# EAGLE board VET6_POD (EAGLE 4.13), part 1 of 2
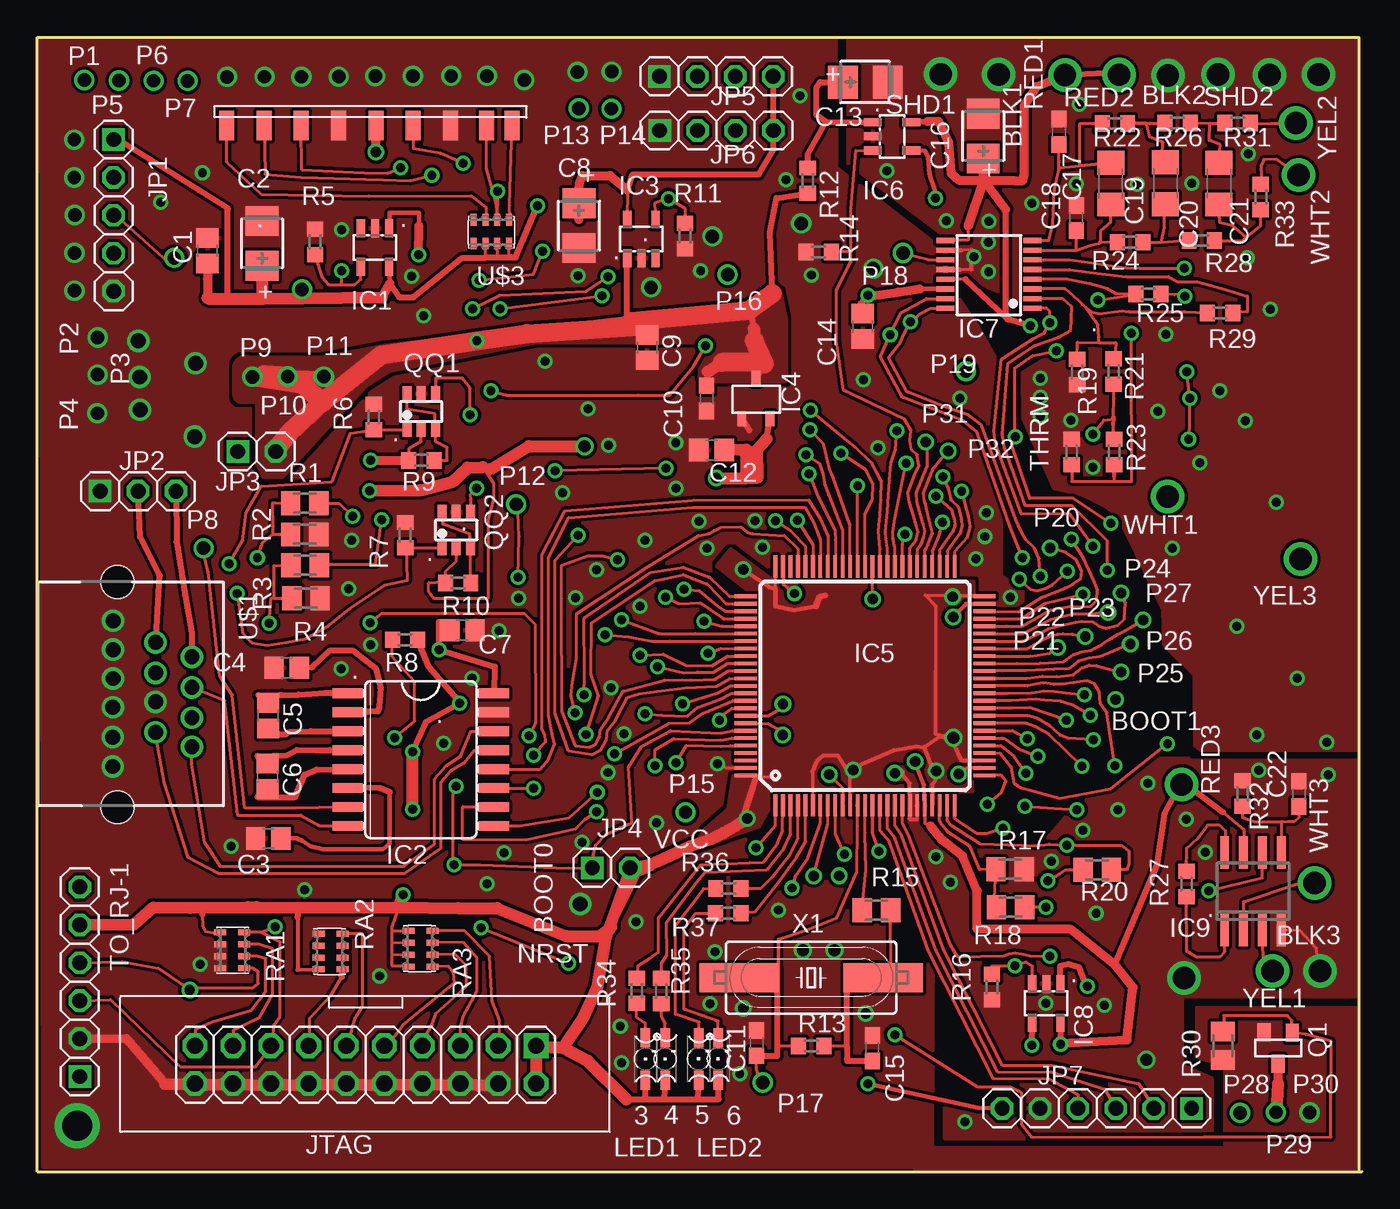
[diagram p2: board, top side]
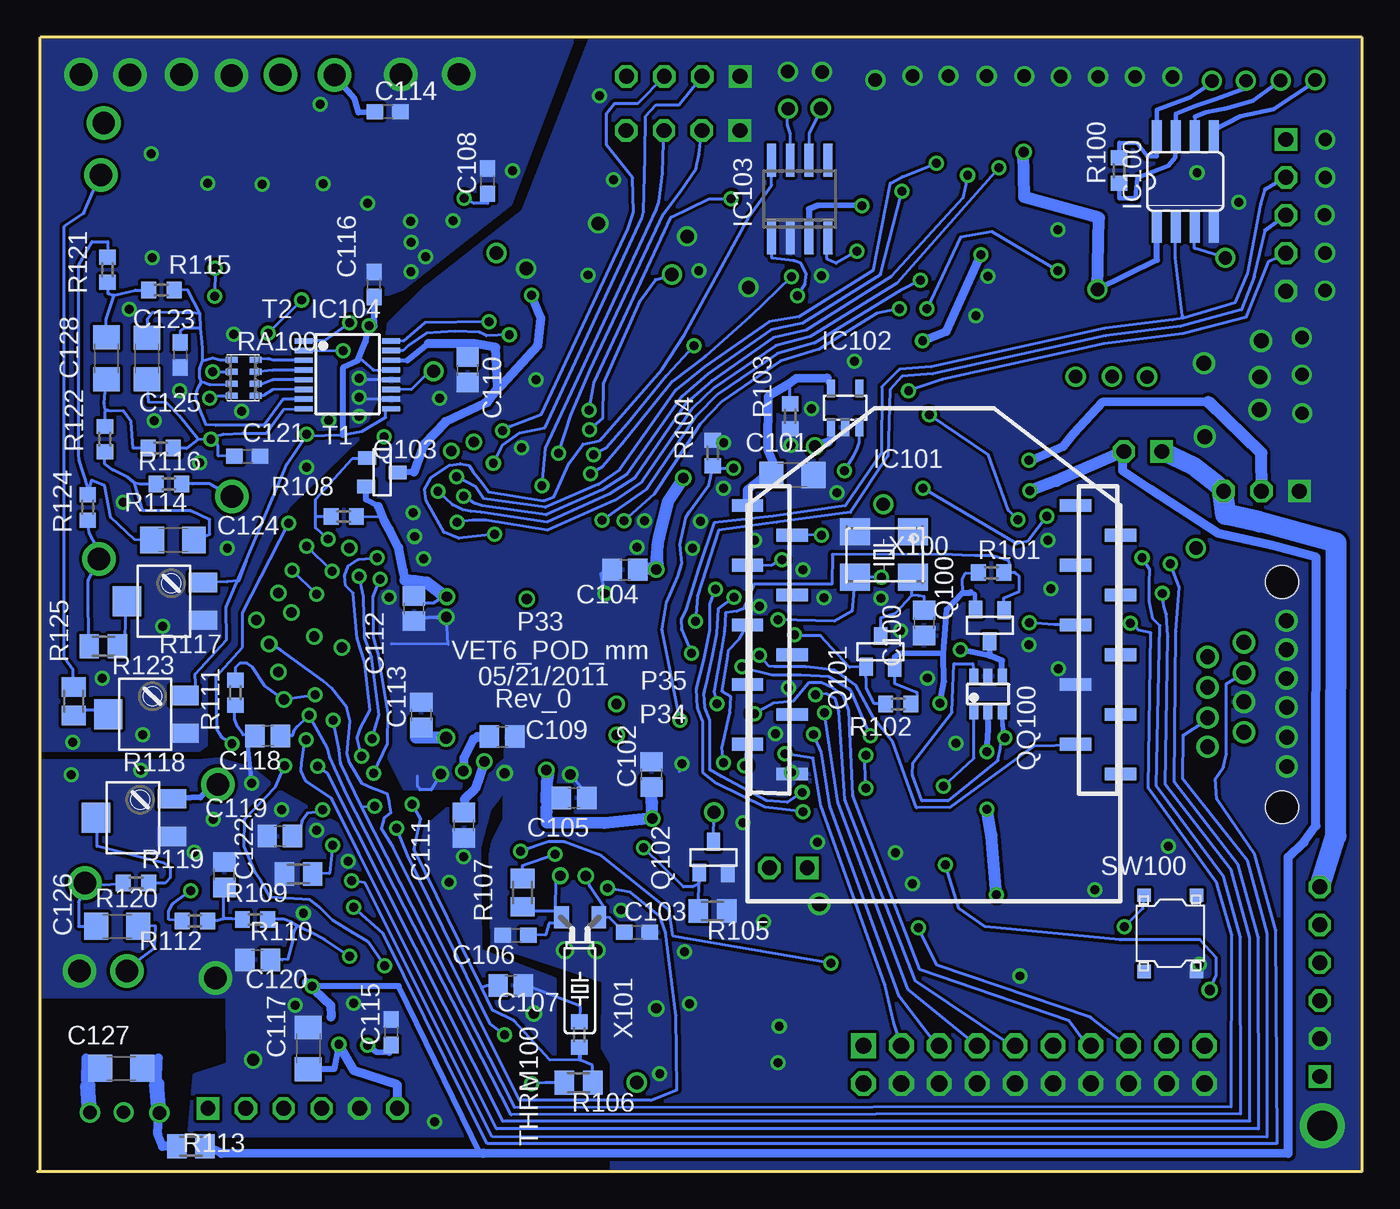
[diagram p3: board, bottom side, seen from below]

Size 88.8 x 76 mm. Coordinates in mm from the lower left corner, seen from the top.
Outline: 88.6,0 0,0 0,76 88.6,76 88.6,0
Outline: 88.6,0 88.8,0
Copper layers (1*16): Top 0.035mm / dielectric 1.5mm / Bottom 0.035mm
Design rules "default": minimum track width 8mil, minimum drill 0.6mm, track to track 8.5mil, track to pad 8mil, pad to pad 8mil, via to via 8mil, smd to smd 0mil, copper to edge 1mil, drill to drill 9mil, minimum pad ring 8mil, minimum via ring 8mil, stop-mask expansion 4mil, vias tented up to drill 0mil, thermal gap 0mil
tRestrict: area 40.2,7 to 46.2,8.2

## Footprints (pad centres in the part's own frame; a part is rotated, then mirrored left to right if it is on the bottom)
SOLPAD060 = drill 1.5 pad 2.184 round: MP 0,0
SOLPAD028 = drill 0.7 pad 1.016 round: MP 0,0
C0805 = smd 1.3 x 1.5: 1 -0.85,0; 2 0.85,0
CT3528 = smd 2 x 2.2: + 1.5,0; - -1.5,0
C0603 = smd 1.1 x 1: 1 -0.85,0; 2 0.85,0
C1206 = smd 1.6 x 1.8: 1 -1.4,0; 2 1.4,0
SOT-25 = smd 0.55 x 1.2: 1 -0.95,-1.3; 2 0,-1.3; 3 0.95,-1.3; 4 0.95,1.3; 5 -0.95,1.3
SO16L = smd 0.66 x 2.032: 1 -4.445,-4.902; 2 -3.175,-4.902; 3 -1.905,-4.902; 4 -0.635,-4.902; 5 0.635,-4.902; 6 1.905,-4.902; 7 3.175,-4.902; 8 4.445,-4.902; 9 4.445,4.902; 10 3.175,4.902; 11 1.905,4.902; 12 0.635,4.902; 13 -0.635,4.902; 14 -1.905,4.902; 15 -3.175,4.902; 16 -4.445,4.902
SOT-23A = smd 0.6 x 1: P$1 -0.95,-1.35; P$2 0.95,-1.35; P$3 0,1.35
TQFP100 = smd 1.5 x 0.25: 1 -8,6; 2 -8,5.5; 3 -8,5; 4 -8,4.5; 5 -8,4; 6 -8,3.5; 7 -8,3; 8 -8,2.5; 9 -8,2; 10 -8,1.5; 11 -8,1; 12 -8,0.5; 13 -8,0; 14 -8,-0.5; 15 -8,-1; 16 -8,-1.5; 17 -8,-2; 18 -8,-2.5; 19 -8,-3; 20 -8,-3.5; 21 -8,-4; 22 -8,-4.5; 23 -8,-5; 24 -8,-5.5; 25 -8,-6; 51 8,-6; 52 8,-5.5; 53 8,-5; 54 8,-4.5; 55 8,-4; 56 8,-3.5; 57 8,-3; 58 8,-2.5; 59 8,-2; 60 8,-1.5; 61 8,-1; 62 8,-0.5; 63 8,0; 64 8,0.5; 65 8,1; 66 8,1.5; 67 8,2; 68 8,2.5; 69 8,3; 70 8,3.5; 71 8,4; 72 8,4.5; 73 8,5; 74 8,5.5; 75 8,6 | smd 0.25 x 1.5: 26 -6,-8; 27 -5.5,-8; 28 -5,-8; 29 -4.5,-8; 30 -4,-8; 31 -3.5,-8; 32 -3,-8; 33 -2.5,-8; 34 -2,-8; 35 -1.5,-8; 36 -1,-8; 37 -0.5,-8; 38 0,-8; 39 0.5,-8; 40 1,-8; 41 1.5,-8; 42 2,-8; 43 2.5,-8; 44 3,-8; 45 3.5,-8; 46 4,-8; 47 4.5,-8; 48 5,-8; 49 5.5,-8; 50 6,-8; 76 6,8; 77 5.5,8; 78 5,8; 79 4.5,8; 80 4,8; 81 3.5,8; 82 3,8; 83 2.5,8; 84 2,8; 85 1.5,8; 86 1,8; 87 0.5,8; 88 0,8; 89 -0.5,8; 90 -1,8; 91 -1.5,8; 92 -2,8; 93 -2.5,8; 94 -3,8; 95 -3.5,8; 96 -4,8; 97 -4.5,8; 98 -5,8; 99 -5.5,8; 100 -6,8
TSSPO16 = smd 0.35 x 1.2: 1 -0.975,-3.025; 2 -0.325,-3.025; 3 0.325,-3.025; 4 0.975,-3.025; 5 1.625,-3.025; 6 2.275,-3.025; 7 2.925,-3.025; 8 3.575,-3.025; 9 3.575,2.825; 10 2.925,2.825; 11 2.275,2.825; 12 1.625,2.825; 13 0.975,2.825; 14 0.325,2.825; 15 -0.325,2.825; 16 -0.975,2.825
SO08 = smd 0.6 x 2.2: 1 -1.905,-2.6; 2 -0.635,-2.6; 3 0.635,-2.6; 4 1.905,-2.6; 5 1.905,2.6; 6 0.635,2.6; 7 -0.635,2.6; 8 -1.905,2.6
SO08' = smd 0.66 x 2.032: 1 -1.905,-3.073; 2 -0.635,-3.073; 3 0.635,-3.073; 4 1.905,-3.073; 5 1.905,3.073; 6 0.635,3.073; 7 -0.635,3.073; 8 -1.905,3.073
XBEE_PRO_SMD = smd 2.1 x 0.85: P$1 -12.5,0; P$2 -9.5,-2; P$3 -12.5,-4; P$4 -9.5,-6; P$5 -12.5,-8; P$6 -9.5,-10; P$7 -12.5,-12; P$8 -9.5,-14; P$9 -12.5,-16; P$10 -9.5,-18; P$11 12.5,-18; P$12 9.5,-16; P$13 12.5,-14; P$14 9.5,-12; P$15 12.5,-10; P$16 9.5,-8; P$17 12.5,-6; P$18 9.5,-4; P$19 12.5,-2; P$20 9.5,0
SO-08 = smd 0.6 x 2.2: 1 -1.905,-2.6; 2 -0.635,-2.6; 3 0.635,-2.6; 4 1.905,-2.6; 5 1.905,2.6; 6 0.635,2.6; 7 -0.635,2.6; 8 -1.905,2.6
1X05 = drill 1 square: 1 -5.08,0 | drill 1 octagon: 2 -2.54,0; 3 0,0; 4 2.54,0; 5 5.08,0
1X03 = drill 1 square: 1 -2.54,0 | drill 1 octagon: 2 0,0; 3 2.54,0
1X02 = drill 1 square: 1 -1.27,0 | drill 1 octagon: 2 1.27,0
1X04 = drill 1 square: 1 -3.81,0 | drill 1 octagon: 2 -1.27,0; 3 1.27,0; 4 3.81,0
1X06 = drill 1 square: 1 -6.35,0 | drill 1 octagon: 2 -3.81,0; 3 -1.27,0; 4 1.27,0; 5 3.81,0; 6 6.35,0
2X10_KEYED = drill 1.1 square: 1 -11.46,-1.27 | drill 1.1 octagon: 2 -11.46,1.27; 3 -8.92,-1.27; 4 -8.92,1.27; 5 -6.38,-1.27; 6 -6.38,1.27; 7 -3.84,-1.27; 8 -3.84,1.27; 9 -1.3,-1.27; 10 -1.3,1.27; 11 1.24,-1.27; 12 1.24,1.27; 13 3.78,-1.27; 14 3.78,1.27; 15 6.32,-1.27; 16 6.32,1.27; 17 8.86,-1.27; 18 8.86,1.27; 19 11.4,-1.27; 20 11.4,1.27
CHIP2LED_1210 = smd 1.27 x 0.635: A -1.422,0.67; A1 -1.422,-0.64; C 1.422,0.67; C1 1.422,-0.64
SOLDPAD035 = drill 0.9 pad 1.27 round: MP 0,0
SOLPAD0.6 = drill 0.7 pad 1.016 round: MP 0,0
SOT-23 = smd 0.9 x 1.2: 1 -1,-1.006; 2 0.9,-1.056; 3 -0.05,1.056
TSOP6 = smd 0.6 x 1: P$1 -0.95,-1.2; P$2 0,-1.2; P$3 0.95,-1.2; P$4 0.95,1.2; P$5 0,1.2; P$6 -0.95,1.2
M0805 = smd 1.3 x 1.6: 1 -0.95,0; 2 0.95,0
R0603 = smd 1 x 1.1: 1 -0.85,0; 2 0.85,0
SM42X = smd 1.3 x 1.9: A -1.27,-2.55; E 1.27,-2.55 | smd 2 x 1.9: S 0,2.55
EXB-38 = smd 0.4 x 0.8: P$1 -1.2,0.7; P$2 -0.4,0.7; P$3 0.4,0.7; P$4 1.2,0.7; P$5 1.2,-0.9; P$6 0.4,-0.9; P$7 -0.4,-0.9; P$8 -1.2,-0.9
E-SWITCH = smd 0.9 x 0.9: P$1 -2.55,1.75; P$2 2.55,1.75; P$3 -2.55,-1.75; P$4 2.55,-1.75
8P8C = drill 1 round: 1 3.445,4.99; 2 2.475,2.55; 3 1.505,4.99; 4 0.435,2.55; 5 -0.535,4.99; 6 -1.505,2.55; 7 -2.575,4.99; 8 -3.545,2.55 | hole 2.2: -7.6,0; 7.5,0
SD_CARD_SMD_PADS_STRAIN_HOLES = smd 1 x 2: P$1 6.77,1.385; P$2 4.27,1.385; P$3 1.77,1.385; P$4 -0.73,1.385; P$5 -3.23,1.385; P$6 -5.73,1.385; P$7 -8.15,1.385; P$8 -9.85,1.385; P$9 9.27,1.385
HC49UP = smd 5.334 x 1.93: 1 -4.826,0; 2 4.826,0
FOX924B_TCXO = smd 2 x 1.8: 1 -1.894,-1.524; 2 1.994,-1.524; 3 1.994,1.524; 4 -1.894,1.524
TC26H_SMD = smd 1 x 1.5: P$1 -1.29,-0.12; P$2 1.21,-0.12

## Placement (x,y rotation side)
BLK1  SOLPAD060  [SOLPAD060]  64.45,73.52 0 top
BLK2  SOLPAD060  [SOLPAD060]  79.15,73.51 90 top
BLK3  SOLPAD060  [SOLPAD060]  85.97,13.45 0 top
BOOT1  BOOT1  [SOLPAD028]  72.27,31.63 0 top
C1  .1u  [C0805]  11.4,61.7 90 top
C2  47u  [CT3528]  15.06,62.2 270 top
C3  .1u  [C0805]  15.48,22.33 180 top
C4  .1u  [C0805]  16.73,33.76 180 top
C5  .1u  [C0805]  15.48,30.55 270 top
C6  .1u  [C0805]  15.44,26.48 270 top
C7  .1u  [C0805]  28.49,36.27 0 top
C8  4.7u@10v  [CT3528]  36.31,63.38 90 top
C9  .1u  [C0805]  40.88,55.21 270 top
C10  2.2u@16v  [C0603]  44.86,51.8 270 top
C11  15p  [C0603]  48.21,8.62 270 top
C12  4.7u@10v  [C0805]  45.19,48.34 180 top
C13  4.7u@10V  [CT3528]  55.49,73 180 top
C14  .1u  [C0805]  55.33,56.64 270 top
C15  15p  [C0603]  55.96,8.27 270 top
C16  4.7u@10V  [CT3528]  63.4,69.38 270 top
C17  1n  [C0603]  68.48,69.68 90 top
C18  1n  [C0603]  69.63,63.9 90 top
C19  22u@6.3v  [C1206]  71.95,66.2 270 top
C20  22u@6.3v  [C1206]  75.61,66.22 270 top
C21  22u@6.3v  [C1206]  79.19,66.2 270 top
C22  1n  [C0603]  84.56,25.31 90 top
C100  .1u  [C0805]  29.37,36.77 270 bottom
C101  4.7u@10v  [C1206]  38.18,46.68 0 bottom
C102  .1u  [C0805]  47.64,26.62 90 bottom
C103  10p  [C0603]  48.6,16.03 0 bottom
C104  .1u  [C0805]  49.41,40.33 180 bottom
C105  .1u  [C0805]  52.83,25.04 0 bottom
C106  10p  [C0603]  56.74,15.85 180 bottom
C107  .1u  [C0805]  57.07,12.48 0 bottom
C108  470p  [C0603]  58.61,66.37 90 bottom
C109  .1u  [C0805]  57.65,29.14 0 bottom
C110  .1u  [C0805]  59.96,53.72 270 bottom
C111  .1u  [C0805]  60.2,23.21 270 bottom
C112  .1u  [C0805]  63.56,37.73 270 bottom
C113  .1u  [C0805]  63.06,30.6 90 bottom
C114  .1u  [C0603]  65.31,71.01 0 bottom
C115  470p  [C0603]  65.07,9.34 90 bottom
C116  .1u  [C0603]  66.23,59.44 90 bottom
C117  4.7u@10v  [C1206]  70.65,8.26 90 bottom
C118  .1u  [C0805]  73.35,29.2 180 bottom
C119  .1u  [C0805]  72.55,22.48 180 bottom
C120  .1u  [C0805]  74.04,14.19 0 bottom
C121  1n  [C0603]  74.73,47.93 0 bottom
C122  .1u  [C0805]  76.27,19.89 90 bottom
C123  1n  [C0603]  79.21,54.71 270 bottom
C124  22u@6.3v  [C1206]  79.7,42.32 0 bottom
C125  22u@6.3v  [C1206]  81.45,54.48 270 bottom
C126  22u@6.3v  [C1206]  83.45,16.44 180 bottom
C127  4.7u@10v  [C1206]  83.17,6.92 180 bottom
C128  22u@6.3v  [C1206]  84.17,54.5 270 bottom
IC1  XC6701  [SOT-25]  22.64,61.92 180 top
IC2  MAX3232CDW  [SO16L]  25.7,27.61 270 top
IC3  XC6701  [SOT-25]  40.49,62.49 0 top
IC4  MCP1702  [SOT-23A]  48.16,51.8 0 top
IC5  STM32F10XVXT6  [TQFP100]  55.48,32.55 90 top
IC6  MIC5205  [SOT-25]  57.29,69.37 270 top
IC7  AD7799  [TSSPO16]  63.68,58.82 90 top
IC8  MIC5205  [SOT-25]  67.62,11.27 180 top
IC9  IN337  [SO08]  81.48,18.79 0 top
IC100  MAX3488CSA  [SO08']  11.86,66.34 0 bottom
IC101  XBEE-PROSMD  [XBEE_PRO_SMD]  28.7,44.63 0 bottom
IC102  REG113  [SOT-25]  34.65,51.17 0 bottom
IC103  MCP2551  [SO-08]  37.7,65.16 0 bottom
IC104  AD7799  [TSSPO16]  67.91,54.69 270 bottom
JP1  GPS  [1X05]  5.11,64.08 270 top
JP2  BATT  [1X03]  6.75,45.6 0 top
JP3  PWR  [1X02]  14.71,48.25 0 top
JP4  BOOT0  [1X02]  38.47,20.36 0 top
JP5  ENC_1  [1X04]  45.51,73.38 0 top
JP6  ENC_2  [1X04]  45.52,69.76 0 top
JP7  ACCEL  [1X06]  71.02,4.24 180 top
JTAG  JTAG  [2X10_KEYED]  21.97,7.17 180 top
LED1  LED1210_2  [CHIP2LED_1210]  41.43,7.55 90 top
LED2  LED1210_2  [CHIP2LED_1210]  45,7.56 90 top
P1  P9  [SOLDPAD035]  3.15,73.14 0 top
P2  GND  [SOLDPAD035]  4.04,55.89 90 top
P3  GND  [SOLDPAD035]  4.04,53.4 270 top
P4  GND  [SOLDPAD035]  4.03,50.81 90 top
P5  P9  [SOLDPAD035]  5.47,73.11 0 top
P6  P9  [SOLDPAD035]  7.79,73.09 0 top
P7  P9  [SOLDPAD035]  10.07,73.08 0 top
P8  P9  [SOLDPAD035]  11.14,41.78 0 top
P9  +7V  [SOLDPAD035]  14.41,53.26 0 top
P10  +7V  [SOLDPAD035]  16.78,53.28 0 top
P11  +7V  [SOLDPAD035]  19.21,53.27 0 top
P12  PD0  [SOLDPAD035]  32.09,44.72 0 top
P13  +7V  [SOLDPAD035]  36.3,71.24 0 top
P14  +7V  [SOLDPAD035]  38.48,71.21 0 top
P15  PE2_FET  [SOLDPAD035]  43.45,24.08 0 top
P16  PC8  [SOLDPAD035]  46.27,60.11 0 top
P17  OSC_IN  [SOLDPAD035]  48.62,5.97 0 top
P18  PSW_1  [SOLDPAD035]  58.02,61.55 0 top
P19  PSW_2  [SOLDPAD035]  62.24,53.63 0 top
P20  SOLDPAD028  [SOLPAD028]  67.89,41.79 0 top
P21  PE11  [SOLPAD028]  68.39,35.11 0 top
P22  PE12  [SOLPAD028]  70.24,35.86 0 top
P23  PE14  [SOLPAD028]  71.76,37.46 0 top
P24  PE13  [SOLPAD028]  72.64,38.77 0 top
P25  PE8  [SOLPAD028]  72.65,33.47 0 top
P26  PE9  [SOLPAD028]  73.26,35.36 0 top
P27  PE10  [SOLPAD028]  74.1,36.95 0 top
P28  +7V  [SOLDPAD035]  80.62,3.94 0 top
P29  BEEP  [SOLDPAD035]  83.01,3.98 0 top
P30  +7V  [SOLDPAD035]  85.27,3.96 0 top
P31  SOLPAD028  [SOLPAD028]  59.54,48.89 0 top
P32  SOLPAD028  [SOLPAD028]  61.06,48.28 0 top
P33  SOLPAD0.6  [SOLPAD0.6]  55.98,38.37 0 top
P34  SOLPAD0.6  [SOLPAD0.6]  49.96,29.25 0 top
P35  SOLPAD0.6  [SOLPAD0.6]  49.98,31.33 0 top
Q1  IRLML2060  [SOT-23]  83.12,8.29 180 top
Q100  IRLML5103  [SOT-23]  25.01,36.6 180 bottom
Q101  IRLML5103  [SOT-23]  32.23,34.83 0 bottom
Q102  IRLML2060  [SOT-23]  43.43,21.05 0 bottom
Q103  IRLML5103  [SOT-23]  65.7,46.8 270 bottom
QQ1  AO6604  [TSOP6]  25.73,50.92 0 top
QQ2  AO6604  [TSOP6]  28.08,42.99 0 top
QQ100  AO6604  [TSOP6]  25.08,32 0 bottom
R1  18K  [M0805]  17.93,44.8 180 top
R2  10K  [M0805]  17.93,42.69 0 top
R3  3.9K  [M0805]  17.95,40.64 180 top
R4  10K  [M0805]  18.01,38.41 0 top
R5  470K  [R0603]  18.62,62.3 270 top
R6  1M  [R0603]  22.56,50.56 270 top
R7  1M  [R0603]  24.66,42.64 270 top
R8  10K  [R0603]  24.65,35.64 180 top
R9  470K  [R0603]  25.74,47.66 0 top
R10  470K  [R0603]  28.21,39.44 0 top
R11  1M  [R0603]  43.41,62.69 270 top
R12  100  [R0603]  51.64,66.39 270 top
R13  470K  [R0603]  51.87,8.42 0 top
R14  470K  [R0603]  52.37,61.62 0 top
R15  56  [M0805]  56.24,17.51 0 top
R16  1M  [R0603]  63.98,12.37 270 top
R17  1M  [M0805]  65.2,20.25 0 top
R18  10K  [M0805]  65.23,17.72 180 top
R19  33K  [R0603]  69.69,53.58 90 top
R20  10K  [M0805]  71.03,20.22 0 top
R21  10K  [R0603]  72.14,53.61 270 top
R22  330  [R0603]  72.22,70.24 180 top
R23  10K  [R0603]  72.17,48.23 90 top
R24  330  [R0603]  73.23,62.27 180 top
R25  10K  [R0603]  74.47,58.79 0 top
R26  330  [R0603]  76.42,70.25 180 top
R27  2K  [R0603]  77.02,19.27 90 top
R28  330  [R0603]  78.05,62.39 180 top
R29  10K  [R0603]  79.27,57.53 0 top
R30  1M  [M0805]  79.45,8.44 270 top
R31  100  [R0603]  80.45,70.25 180 top
R32  200K  [R0603]  80.77,25.33 270 top
R33  100  [R0603]  82,65.31 270 top
R34  510  [R0603]  40.17,12.12 270 top
R35  510  [R0603]  41.83,12.1 270 top
R36  510  [R0603]  46.32,18.98 180 top
R37  510  [R0603]  46.31,17.31 180 top
R100  120  [R0603]  16.29,67.07 90 bottom
R101  470K  [R0603]  24.86,40.13 0 bottom
R102  470K  [R0603]  31.09,31.34 180 bottom
R103  2K  [R0603]  38.33,50.61 90 bottom
R104  1M  [R0603]  43.53,48.15 90 bottom
R105  1M  [M0805]  43.55,17.46 0 bottom
R106  7.15K  [M0805]  52.52,5.95 0 bottom
R107  47K  [M0805]  56.27,18.7 270 bottom
R108  470K  [R0603]  68.26,43.89 180 bottom
R109  1M  [M0805]  71.3,19.94 180 bottom
R110  1K  [R0603]  74.2,16.89 0 bottom
R111  10K  [R0603]  75.51,32.09 90 bottom
R112  1K  [R0603]  78.23,16.81 180 bottom
R113  100  [M0805]  78.5,1.69 0 bottom
R114  100  [R0603]  79.98,46.09 180 bottom
R115  330  [R0603]  80.48,59.06 0 bottom
R116  330  [R0603]  80.53,48.48 0 bottom
R117  20K  [SM42X]  80.25,38.21 90 bottom
R118  20K  [SM42X]  81.49,30.64 90 bottom
R119  20K  [SM42X]  82.32,23.71 90 bottom
R120  10K  [R0603]  82.18,19.33 180 bottom
R121  330  [R0603]  84.09,60.43 270 bottom
R122  330  [R0603]  84.28,49.07 90 bottom
R123  10K  [M0805]  84.37,35.21 180 bottom
R124  100  [R0603]  85.42,44.51 90 bottom
R125  10K  [M0805]  86.36,31.51 270 bottom
RA1  10K  [EXB-38]  13.16,14.83 270 top
RA2  10K  [EXB-38]  19.55,14.75 90 top
RA3  10K  [EXB-38]  25.59,14.94 90 top
RA100  10K  [EXB-38]  75.07,53.19 90 bottom
RED1  SOLPAD060  [SOLPAD060]  68.88,73.49 0 top
RED2  SOLPAD060  [SOLPAD060]  72.49,73.49 90 top
RED3  SOLPAD060  [SOLPAD060]  76.7,25.95 0 top
SHD1  SOLPAD060  [SOLPAD060]  60.54,73.53 0 top
SHD2  SOLPAD060  [SOLPAD060]  85.88,73.52 90 top
SW100  E-SWITCH  [E-SWITCH]  12.86,15.97 90 bottom
THRM  10K  [R0603]  69.32,48.22 90 top
THRM100  10K  [R0603]  52.47,9.18 90 bottom
TO_RJ-1  [1X06]  2.85,12.72 90 top
U$1  RJ-45  [8P8C]  5.37,31.91 270 top
U$2  SD_SMD_PADSSTRAIN_HOLES  [SD_CARD_SMD_PADS_STRAIN_HOLES]  21.97,71.47 180 top
U$3  10K  [EXB-38]  30.43,62.89 180 top
WHT1  SOLPAD060  [SOLPAD060]  75.76,45.22 90 top
WHT2  SOLPAD060  [SOLPAD060]  84.54,66.77 0 top
WHT3  SOLPAD060  [SOLPAD060]  85.61,19.34 0 top
X1  10 MHZ  [HC49UP]  51.86,13 180 top
X100  FOX924B  [FOX924B_TCXO]  32.01,41.34 180 bottom
X101  32768  [TC26H_SMD]  52.46,16.92 180 bottom
YEL1  SOLPAD060  [SOLPAD060]  82.8,13.45 0 top
YEL2  SOLPAD060  [SOLPAD060]  84.35,70.26 0 top
YEL3  SOLPAD060  [SOLPAD060]  84.67,41.06 90 top

## Tracks (layer width: path | path; a pad name or v marks a point on that pad's centre or on a via)
3.3V_SD_CARD|GPS  (via drill 0.6, 0.7, 0.9)
  Top 0.203: IC1.5 23.61,59.48 | 30.08,61.25 30.03,61.24 30.03,61.26 U$3.P$3 | U$3.P$1 31.62,62.11 31.62,61.27 31.7,61.25 31.77,61.28 | 30.84,61.25 30.84,61.24 U$3.P$2
  Top 0.305: 23.63,59.52 IC1.5
  Top 0.406: 23.61,59.48 24.23,58.6 25.19,58.57 28.48,61.23 30.03,61.24 | 30.08,61.25 30.84,61.25 31.7,61.25 | 11.55,58.48 11.49,58.53 12.77,58.55 12.77,64.53 5.69,68.95 4.73,69.18 JP1.1 | 11.41,58.54 11.43,58.5 | v33.52,64.72 32.06,61.26 31.77,61.28
  Top 0.61: 11.41,58.54 11.41,59.8 11.39,60.81 C1.1 | 23.09,58.58 23.63,59.52 | v22.71,68.3 U$2.P$4
  Top 0.813: 15.12,58.48 C2.+ | 11.41,58.54 11.55,58.48 15.12,58.48 | 15.12,58.48 17.76,58.51 | 17.76,58.51 23.09,58.58 | 17.76,58.51 v17.75,59.11
  Bottom 0.406: IC100.1 13.76,61.09 17.84,59.08 v17.75,59.11 | IC103.3 37.08,64.49 36.45,64.74 v33.52,64.72
  Bottom 0.813: v22.71,68.3 22.66,65.29 17.65,63.9 v17.75,59.11
3.3V_TXCO+SUPPLY
  Bottom 0.203: Q101.3 32.28,37.08 31.32,37.4 30.18,38.6 | X100.4 30.16,39.69 30.18,38.6 | 30.18,38.6 29.71,38.58 29.36,38.53 29.35,37.69 C100.1
+3.3V/XB
  Bottom 0.203: R103.2 38.38,51.98 38.39,52.87 38.5,52.74
  Bottom 0.406: 35.86,53.18 IC102.5
  Bottom 0.61: 35.86,53.18 37.94,53.16 38.5,52.74 39.79,51.97 39.83,48.34 39.13,46.73 C101.1 39.09,46.48 40.19,46.5 41.19,45.71 IC101.P$1
+5V/2  (via drill 0.6)
  Top 0.203: 60.82,62.35 IC7.9 60.89,62.4 62.4,62.41 62.38,63.35 | R21.2 72.17,51.79 72.13,50.56 | R23.2 72.1,49.27 72.1,50.05 | v70.75,49.4 70.98,49.72 71.48,50.34 72.18,50.45 72.12,50.45 | 62.21,59.79 IC7.13
  Top 0.254: 72.1,50.05 72.12,50.45 72.13,50.56
  Top 0.406: 64.91,64.47 64.91,57.67 64.91,57.63 64.99,57.14 65.05,57.12 | 59.68,70.35 IC6.5 | 65.31,66.41 65.46,66.41 | 63.43,66.42 63.49,66.42 63.49,66.4 | RED2.MP 73,73.69 RED1.MP | v66.57,56.66 65.05,57.12 | 62.21,59.79 63.83,58.24 65.05,57.11 65.05,57.12
  Top 0.61: RED1.MP 66.95,72.69 66.17,71.5 66.16,66.82 66.04,66.4 65.46,66.41 | 59.68,70.35 60.43,70.36 61.09,68.93 61.27,66.84 61.81,66.4 63.43,66.4 | 63.43,66.42 C16.+ | 63.49,66.42 65.31,66.41 | 63.43,66.4 63.49,66.4 63.48,66.38 64.91,64.47 | 63.43,66.4 63.43,66.41 62.38,63.35
  Bottom 0.203: IC104.9 65.45,51.14 65.45,50.53 67.02,49.62 68.31,49.36 70.71,49.3 70.77,49.31 | 68.3,53.89 68.04,54.04 67.24,54.52 66.3,53.71 IC104.13 | R117.E 76.08,39.51 75.3,39.59 74.79,40.94 | 74.79,40.94 72.05,47.44 70.77,49.31 | R118.E 78.83,32.18 78.14,32.06 78.22,33.33 76.11,35.62 76.13,37.82 74.79,40.94 | v70.75,49.4 71.12,49.53 70.77,49.31
  Bottom 0.406: RED1.MP 68.96,73.67 68.23,72.69 67.58,71.93 67.28,70.98 C114.1 | 68.31,49.36 68.3,53.89 67.32,54.34 66.78,55.63 v66.57,56.66 66.19,56.67 66.24,57.56 C116.1
+5V/3
  Top 0.203: 39.55,65.77 IC3.5 | C8.+ 36.31,63.81
  Top 0.406: 39.55,65.77 39.9,66.81 48.37,66.81 49.33,68.45 49.38,69.75 JP6.4 49.34,73.32 JP5.4 | 36.35,66.27 36.35,65.91
  Top 0.61: 39.55,65.77 38.39,66.73 36.54,66.73 36.35,66.27 36.31,65.74 36.31,63.81
+7V  (via drill 0.6, 0.8)
  Top 0.203: QQ2.P$2 28.1,40.94 27.36,40.22 27.41,39.41 R10.1 27.23,39.53 26.23,39.47 26.23,38.86 26.56,38.4 30.2,38.4 30.2,43.7 30.59,45.1 30.59,46.13 29.86,47.2 | 48.73,54.1 48.74,54.08 48.53,54.24
  Top 0.305: IC1.1 23.62,64.24 25.6,64.24 25.58,63.37 | JP3.2 16.06,48.52
  Top 0.406: 49.26,58.83 49.1,62.94 49.53,65.22 R12.2 | 48.73,54.1 IC4.P$3 | 47.72,57.7 48.02,56.51 | 44.94,53.6 C10.1 | 48.53,54.24 48.54,54.52 | 39.81,56.98 39.53,56.46 IC3.1 | IC8.1 68.55,13.77 69.1,13.9 69.83,13.67 70.25,12.62 v70.39,12.43
  Top 0.61: 29.86,47.2 30.38,47.07 | v25.57,61.44 25.58,63.37
  Top 0.813: v22.29,45.61 25.68,45.66 27.83,46.23 28.83,47.17 29.86,47.2 | 32.82,56.14 39.81,56.98 | 48.02,56.51 48.04,55.68 | 45.92,54.22 44.94,53.6 | 30.38,47.07 32.93,48.6 v36.68,48.6 | 14.43,53.24 P10.MP | 15.23,53.41 P11.MP | 19.09,51.56 19.13,51.52
  Top 1.27: 16.06,48.52 16.98,49.6 19.09,51.56 23.07,54.72 v29.46,55.66 32.82,56.14 40.82,56.66 | 39.81,56.98 47.72,57.7 49.26,58.83 | 48.04,55.68 48.73,54.1 | 48.53,54.24 45.92,54.22 | 14.43,53.24 P9.MP 17.83,52.71 19.13,51.52 | P10.MP 15.23,53.41
  Bottom 0.305: IC102.1 35.61,49.19 35.76,48.92
  Bottom 0.406: v70.39,12.43 64.58,12.44 59.1,1.14 58.9,1.23 58.91,1.21 | 15.99,48.29 JP3.2
  Bottom 0.61: v29.46,55.66 27.87,56.3 v25.57,61.44 | 58.9,1.23 4.96,1.21 4.97,21.07 3.9,22.06 3.1,23.17 3.08,41.16 6.11,41.98 9.6,42.74 14.2,45.73 16.04,46.96 15.99,48.29 | v36.68,48.6 35.76,48.92 | 58.91,1.21 76.45,1.22 77.42,1.69 R113.2 | 69.11,10.35 69.13,11.14 70.75,12.66 v70.39,12.43
  Bottom 0.813: JP3.2 20.49,46.27 v22.29,45.61
  pour Top: 14.79,51.6 13.71,51.59 arc-90 13.25,52.27 13.25,53.98 arc-90 14.13,54.5 14.33,54.5 19.1,54.5 23.3,55.3 39.74,57.19 48.1,57.4 49.72,58.97 50.1,57.05 50.1,53 44.5,53 44.52,55.56 39.8,55.6 33.4,55.6 23.6,53.7 22,52.7 16.4,46.6 15.2,46.6 14.8,47.4
+7V_VIA_RESISTOR
  Top 0.406: C13.+ 52.47,73 52.22,72.59 52.23,70.77 52.86,70.33 | IC6.1 55.97,70.31 52.86,70.33 | R12.1 51.65,68.19 52.86,70.33
AD7799_1_AIN1+
  Top 0.203: IC7.5 69.2,60.44 71.04,60.19 72.99,59.96 75.81,59.97 76.45,59.62 77.74,59.63 79.35,59.17 81.11,58.65 81.11,57.61 R29.2
AD7799_1_AIN1-  (via drill 0.6)
  Top 0.203: IC7.6 69.24,61.09 72.95,60.57 73.88,60.54 76.47,60.53 76.42,60.56 77.03,60.55 v76.88,60.52 | v76.91,58.65 76.6,58.78 76.23,58.74 R25.2
  Bottom 0.203: v76.88,60.52 v76.91,58.65
AD7799_1_AIN3+
  Top 0.203: IC7.3 68.9,59.14 69.77,58.39 70.04,58.12 70.29,57.88 | 69.86,54.86 R19.2 69.72,55.58 71.14,55.54 | R29.1 76.94,57.62 73.15,57.62 72.7,57.67 71.17,57.48 70.62,57.61 70.29,57.88 | 71.14,55.54 72.28,55.54 72.24,54.49 R21.1 | 71.14,55.54 71.15,55.93 71.08,56.72 70.29,57.88
  Top 0.254: R21.1 72.1,54.45
AD7799_1|PAD
  Top 0.203: IC7.11 61.04,61.03 60.38,61.11 59.68,61.11 59.71,61.11 P18.MP
AD7799_2_AIN1+
  Bottom 0.203: IC104.5 73,53.05 73.83,52.74 RA100.P$7
AD7799_2_AIN1-
  Bottom 0.203: IC104.6 73.02,52.4 73.67,51.99 RA100.P$8
AD7799_2_AIN3+
  Bottom 0.203: IC104.3 73,54.37 73.34,54.46 74.2,54.4 RA100.P$5
AD7799_2_AIN3-
  Bottom 0.203: IC104.4 73.04,53.69 74.2,53.57 RA100.P$6
AD7799_2|PAD
  Bottom 0.203: IC104.11 63.74,52.4 62.37,53.75 P19.MP
ADC_IN13|OP_AMP_OUT_FILTERED  (via drill 0.6)
  Top 0.203: IC5.18 57.98,23.39 58.38,22.56 61.19,15.2 61.66,14.41 64.78,14.45 65.11,14.59 65.52,14.65 65.97,14.59 66.52,14.45 v67.88,14.45
  Bottom 0.203: v67.88,14.45 69.46,15.5 70.14,15.88 71.39,16.46 | 71.39,16.46 71.84,16.73 72.31,16.92 73.07,16.9 R110.2 | 71.39,16.46 71.61,16.06 71.7,15.48 72.02,14.23 72.36,14.19 C120.2
ADS7799_1_AIN3-  (via drill 0.6)
  Top 0.203: IC7.4 69.01,59.79 70.51,59.5 71.72,59.15 72.3,58.81 R25.1 v71.1,58.4 | 72.19,46.24 72.18,46.61 | 72.19,46.24 69.33,46.25 69.33,47.38 THRM.1 | v73.33,56.18 73.33,55.13 73.34,46.24 72.22,46.24 72.19,46.24
  Top 0.254: 72.18,46.61 R23.1
  Bottom 0.203: v73.33,56.18 v71.1,58.4
BOOT0  (via drill 0.6, 0.7)
  Top 0.203: IC5.94 46.58,29.55 45.79,29.38 42.45,29.55 40.51,28.49 39.62,27.09 39.85,23.39 39.05,23.04 38.09,22.58 37.44,21.9 37.23,21.12 37.01,20.5 JP4.1 37.04,20.35 35.6,20.34 29.7,20.55 v27.92,20.56 27.86,20.8 27.86,25.21 v28.06,25.83 | TO_RJ-1.4 5.68,14.06 6.64,13.88 8.09,13.63 v10.21,12.18 10.15,12.25 10.05,12.3 14.47,12.32 14.81,12.59 14.81,13.39 14.42,13.64 RA1.P$4
  Bottom 0.203: v27.92,20.56 27.04,17.64 25.26,16.41 16.23,15.53 10.88,15.55 9.78,14.34 9.78,13.15 v10.21,12.18 | v28.06,25.83 26.02,27.7 26.04,29.58 26.04,30.76 QQ100.P$1
BOT_CELL_N-DRAIN_P-GATE
  Top 0.203: QQ1.P$6 24.78,51.09 26.66,50.77 26.66,49.81 QQ1.P$3 26.68,48.92 27.48,48.51 27.48,47.66 R9.2
BRDIGE1_YELLOW_AIN1-
  Top 0.203: IC7.8 67.8,62.4 68.06,63.49 68.18,65.78 68.5,67.27 | 68.5,67.27 C19.1 69.86,67.4 69.89,70.23 R22.2 | C17.1 68.47,67.75 68.47,67.6 68.48,67.12 68.5,67.27
BRDIGE2_YELLOW_AIN1+
  Bottom 0.203: 77.72,54.32 77.03,54.52 76.53,54.38 RA100.P$4 | 77.72,54.32 77.92,53.78 77.9,53.18 77.78,52.93 | 77.78,52.93 77.62,52.89 77.21,52.73 75.75,52.76 RA100.P$2 | C125.1 81.44,57.06 81.06,57.57 78.94,57.56 78.51,57.55 77.89,57.47 | R115.2 78.72,59.08 77.89,57.47 | 77.86,56.5 77.76,55.57 77.73,55.13 77.72,54.32 | 77.86,56.5 77.89,57.47 | IC104.7 72.33,51.75 73.6,50.01 76.83,50 77.49,50.05 77.97,51.27 78.18,51.84 78.11,52.26 77.98,52.59 77.78,52.93 | C123.1 79.22,56.34 78.99,56.49 77.87,56.5 77.86,56.5
BRIDGE1_FILTER+_1
  Top 0.203: R33.2 82,63.36 81.05,62.6 | 81.05,62.6 80.79,62.38 79.45,62.35 R28.1 | C21.2 79.25,63.59 80.14,63.36 81.04,62.61 81.05,62.6
BRIDGE1_FILTER+_2
  Top 0.203: R24.1 74.05,62.28 75.33,62.28 | 75.33,62.28 76.53,62.38 R28.2 | C20.2 75.19,64.15 75.54,64.12 75.54,63.26 75.33,62.28
BRIDGE1_FILTER-_1
  Top 0.203: R26.1 77.41,70.22 78.59,70.24 | 78.59,70.24 R31.2 | C21.1 79.28,68.8 78.55,69.1 78.59,70.21 78.59,70.24
BRIDGE1_FILTER-_2
  Top 0.203: R26.2 74.56,70.25 73.63,70.25 | 73.63,70.25 R22.1 | C20.1 75.42,68.09 75.44,68.95 74.56,69.31 74.33,70.23 73.63,70.25
BRIDGE1_WHITE_AIN2+
  Top 0.203: C19.2 71.95,63.6 71.29,63.05 71.27,62.39 71.19,62.2 | IC7.7 69.64,61.74 | 69.64,61.74 70.59,62.06 71.19,62.2 | 71.19,62.2 71.25,62.28 72.41,62.29 R24.2 | 69.64,61.74 69.63,61.77 C18.1
BRIDGE1_WHITE_SIG+
  Top 0.203: WHT2.MP 83.06,67.82 82.2,67.81 82.02,67.37 82.06,66.12 R33.1
  Bottom 0.203: R125.1 86.4,33.59 86.98,34.42 86.99,63.33 85.67,64.21 84.61,66.68 WHT2.MP
BRIDGE1_YELLOW_SIG-
  Top 0.203: YEL2.MP 82.68,70.24 81.48,70.22 R31.1
BRIDGE2_FILTER+_1
  Bottom 0.203: C124.2 77.24,42.71 77.24,43.69 78.53,44.27 81.74,44.3 82.28,46.13 82.74,46.52 | 82.74,46.52 82.28,46.15 81.93,46.08 R114.2 | R122.1 84.27,47.41 83.75,47.02 83.28,46.8 82.74,46.52
BRIDGE2_FILTER+_2
  Bottom 0.203: R116.1 82.37,48.48 82.51,50.24 83.03,50.97 | R122.2 84.28,50.94 83.03,50.97 | C128.2 84.31,51.46 84.25,51.06 83.89,50.96 83.03,50.97
BRIDGE2_FILTER-_1
  Bottom 0.203: R121.1 84.08,62.31 85.13,62.3 86.02,60.74 86.03,48.11 85.98,47.66 85.41,45.88 R124.2 85.18,46.32 84.3,45.96 83.89,43.83 82.27,42.35 C124.1
BRIDGE2_FILTER-_2
  Bottom 0.203: R115.1 82.21,59.06 83.65,58.72 | R121.2 84.04,58.91 84.03,58.8 83.83,58.74 83.65,58.72 | C128.1 84.17,57.12 83.65,58.72
BRIDGE2_WHITE_AIN1-  (via drill 0.6)
  Top 0.203: v77.04,53.61 v77.26,51.82 77.24,49.99 77.18,49.05 v77.16,49.06
  Bottom 0.203: IC104.8 72.29,51.08 73.45,49.47 75.06,49.49 76.31,49.42 76.94,49.27 | R116.2 78.79,48.46 78.03,49.08 | 76.94,49.27 77.23,49.04 | 77.23,49.04 78.03,49.08 | C125.2 81.35,51.56 80.12,51.5 79.3,50.66 78.03,49.08 | C121.1 76.67,47.96 76.69,48.6 76.94,49.27 | RA100.P$1 76.01,51.99 76.12,51.99 76.64,51.98 v77.26,51.82 | v77.04,53.61 RA100.P$3 | 77.23,49.04 77.19,48.73 v77.16,49.06
BRIDGE2_WHITE_SIG+
  Bottom 0.203: WHT1.MP 77.24,46.08 78.38,46.08 R114.1
BRIDGE2_YELLOW_SIG-
  Bottom 0.203: R123.2 85.37,37.78 85.37,39.61 YEL3.MP 84.56,41.37 85.31,42.8 R124.1
BRIDGE_WHITE
  Top 0.203: IC9.2 80.85,18.09 84.33,19.25 85.64,19.3 WHT3.MP
  Bottom 0.203: R120.2 84.33,19.21 WHT3.MP 86.04,18.07 86.04,16.44 C126.2
BRIDGE_YELLOW
  Top 0.203: IC9.3 82.17,14.32 83.02,13.34 YEL1.MP
  Bottom 0.203: C126.1 80.87,16.47 80.93,14.99 82.94,13.49 YEL1.MP
C1+
  Top 0.406: IC2.1 19.84,32.08 19.29,32.07 17.52,31.95 14.81,31.93 16.37,31.95 16.02,31.88 C5.1
C1-
  Top 0.406: IC2.3 19.84,29.5 19.15,29.5 18.35,29.51 16.89,29.47 16.66,29.31 16.27,29.29 C5.2
C2+
  Top 0.406: IC2.4 19.59,28.24 18.72,28.23 17.4,28.25 16.75,27.91 14.74,27.84 16,27.31 C6.1
C2-
  Top 0.406: IC2.5 18.69,26.94 17.91,26.59 17.28,25.09 14.74,25.09 15.6,25.71 C6.2
GND  (via drill 0.6, 0.7, 0.8, 0.9, 1, 1.5, 2 pad 1.27)
  Top 0.203: IC5.99 46.21,27.05 v45.6,27.34 | IC5.27 62.31,27.05 v61.75,26.65 | IC5.10 53.98,25.69 v53.06,26.61 | IC5.74 50,39.31 v50.76,38.74 | 62.62,61.75 IC7.10 | IC7.12 62.62,60.47 | IC9.4 84.64,16.13 85.73,14.97 BLK3.MP | IC5.20 58.98,24.08 58.95,23.59 58.95,23.95 IC5.20
  Top 0.254: IC5.20 58.95,24.5 | IC5.49 62.26,38.06 v61.38,37.16 | 57.85,26.75 58.46,26.01 58.48,24.59 IC5.19 58.49,23.58 58.95,23.59
  Top 0.305: 62.62,60.47 62.62,61.75 | 60.89,60.45 61.85,60.44 | 61.95,61.73 60.98,61.74
  Top 0.406: IC4.P$1 47.73,49.64 | 44.87,50.59 C10.2
  Top 0.61: 57.61,26.75 57.85,26.75 v57.48,26.69 | TO_RJ-1.2 5.97,8.94 8.56,5.89
  Top 0.813: JTAG.4 31.04,5.71 JTAG.6 28.49,5.76 JTAG.8 25.93,5.79 JTAG.10 23.32,5.77 JTAG.12 20.8,5.79 JTAG.14 18.32,5.77 JTAG.16 15.78,5.77 JTAG.18 10.56,5.79 JTAG.20 10.59,5.84 8.56,5.89
  Bottom 0.203: v45.6,27.34 45.76,26.8 | 63.33,26.52 63.33,25.82 63.16,25.58 62.39,25.58 v61.75,26.65 | v53.06,26.61 52.21,25.58 52.23,24.6 | v50.76,38.74 51.02,40.08 50.68,40.45 | 65.07,35.35 61.26,35.33 61.38,37.07 v61.38,37.16 | THRM100.2 52.42,10.03 52.42,10.16 52.41,11.07 55.82,12.37 | R111.1 75.59,30.67 75.56,30.31 75.36,29.8 75.01,29.26 C118.2 74.7,28.6 | 65.42,51.76 66.73,51.76 | 65.4,53.06 66.71,53.06 | v74.44,26.02 74.43,26.05
  Bottom 0.254: v61.38,37.16 62,37.14 63.16,37.08
  Bottom 0.305: 74.43,26.05 74.7,28.6
  Bottom 0.61: 85.41,5.78 85.55,6.07 85.53,7.6 84.59,6.88 C127.2
  Bottom 1.016: P30.MP 85.41,5.78
  other vias: 51.32,14.82 70.09,22.86 60.21,21.09 71.52,11.14 74.34,7.49 61.19,19.39 67.96,20.81 72.42,24.26 51.9,60.07 22.93,13.11 17.93,18.87 12.99,21.81 30.95,36.23 22.34,35.31 20.36,33.68 44.34,43.58 40.72,42.29 44.88,41.77 49.68,17.53 62.17,3.34 27.24,28.72 70.97,17.31 10.91,13.89 29.13,33.07 34.02,54.3 45.25,62.66 41.13,59.25 36.24,60.04 36.91,51.12 35.2,45.5 38.27,48.66 42.8,45.79 56.34,48.49 5.08,36.91 5.08,34.98 5.08,33.04 5.06,31.11 5.06,29.11 5.06,27.15 6.78,55.66 6.86,53.24 6.89,51.05 82.58,73.48 75.78,73.45 12.72,73.35 25.88,57.36 82.63,57.77 47.32,10.95 30.15,19.29 41.49,23.38 42.79,48.83 11.07,66.92 8.28,64.95 15.23,73.36 17.7,73.36 20.2,73.36 22.65,73.4 25.17,73.41 27.73,73.41 30.14,73.42 32.63,73.14 2.68,3.08 36.2,73.69 38.49,73.7 25.1,59.99 20.4,63.11 48.09,43.62 48.59,41.82 36.38,17.93 38.24,26.74 31.29,21.37 36.5,22.07 39.32,29.35 38.45,32.42 37.48,40.33 36.08,38.46 32.26,38.41 40.4,37.88 51.2,63.53 63.5,42.55 62.92,41.06 65.23,38.47 63.6,44.14 67.61,11.27 20.88,39.05 21.06,42.3 50.18,66.46 51.11,72.1 44.47,60.36 75.1,50.95 61.83,51.81 56.95,67.06 63.76,60.3 63.73,62.28 63.77,63.69 67.24,51.88 69.28,50.33 67.24,50.6 70.73,47.19 62.77,61.3 80.38,36.55 84.45,33.05 81.1,61.23 66.65,64.87 60.93,63.72 77,23.61 81.88,26.89 78.3,21.39 56.03,60.5 76.85,12.97 81.74,29.27 76.06,41.76 86.42,28.78 86.53,26.58 79.25,52.32 75.63,56.12 67.24,53.17 69.65,66.19 69.84,71.51 77.9,47.51 80.95,50.32 55.37,53.05 2.48,69.14 2.48,66.61 2.51,64.09 2.49,61.56 2.49,59.02 73.74,66.17 77.39,66.23 81.17,68.19 83.03,44.84 10.61,54.16 10.54,49.24 40.12,16.75 39.07,9.73 45.08,11.25 45.41,14.73 55.53,10.6 39.15,7.29 47.08,6.55 53.43,14.82
  pour Top (rank 4): 0.39,0.32 59.97,0.32 60.04,16.83 57.04,23.36 61.95,23.3 64.54,31.77 64.58,37.95 66.03,37.95 66.03,38.95 64.59,39.94 64.55,53.92 62.98,56.71 60.94,59.74 60.93,61.58 53.51,67.31 53.5,76.45 0.26,76.42
  pour Bottom (rank 4): -0.48,76.7 -0.12,-0.72 50.28,-0.24 50.28,7.2 50.88,8.28 50.84,12.8 58.28,15.24 58.4,21.27 58.22,22.1 57.47,23.59 57.42,26 57.34,30.09 59.28,30.11 60.45,25.73 64.15,25.67 65.21,27.84 65.94,28.48 70.46,42.59 67.52,44.96 66.07,45.53 66.17,48.68 65.21,56.81 62.73,59.24 56.2,64.38 51.42,76.63
  pour Bottom: 54.13,12.9 59.12,14.79 59.2,21.76 58.53,24.25 57.26,25.88 57.49,27.56 60.91,24.66 64.97,21.18 72.53,25.45 74.4,26.95 76.64,27.64 77.97,27.49 90.03,27.5 90.11,11.74 76.05,11.77 76,7.19 78.27,6.46 78.62,2.4 54.15,2.44
  pour Top (rank 3): 60.83,2.23 60.86,16.84 57.42,23.82 57.69,24.84 60.21,24.67 63.8,21.72 67.34,21.88 72.28,27.66 77.1,27.71 77.35,27.54 89.67,27.54 89.66,11.77 76.7,11.76 76.71,7.08 78.73,6.22 78.72,5.21 78.72,2.23
  pour Top (rank 3): 71.44,44.68 72.43,43.98 73.35,42.12 75.46,37.67 75.52,35.3 77.57,33.29 77.62,28.58 77.98,28.26 88.72,28.26 89.03,76.8 54.35,76.79 54.36,67.56 61.62,62.06 61.7,60.3 66.24,58.07 69.86,58.04 69.84,55.9 66.06,53.54 66.09,50.52 68.18,45.8 70.05,45.39
  pour Bottom (rank 3): 71.89,44.67 72.97,42.97 75.33,37.79 75.2,35.23 77.51,33.13 77.52,28.56 77.98,28.24 88.98,28.27 88.95,76.64 52.7,76.46 57.1,64.83 64.29,59.2 66.5,58.36 66.14,54.38 66.17,51.73 67.17,49.27
  pour Top: 58.84,1.65 79.61,1.65 79.6,7.01 77.69,7.67 77.71,11.02 88.76,11.02 88.76,-0.77 58.84,-0.78
IC6_BYP  (via drill 0.6)
  Top 0.203: 60.16,65.74 60.16,65.56 v60.2,65.22
  Top 0.305: 60.16,65.74 59.83,66.74 59.77,67.16 59.68,67.99 59.49,68.41 58.64,68.44 IC6.4
  Bottom 0.203: C108.1 58.6,64.88 59.54,64.88 60.23,65.23 v60.2,65.22
IC8_BYP  (via drill 0.6)
  Top 0.406: IC8.4 66.69,9.91 v66.67,8.46
  Bottom 0.203: 65.21,7.95 65.2,7.92 C115.1
  Bottom 0.406: 65.21,7.95 66.06,8 v66.67,8.46
JTAG_R-TO-GND-11
  Top 0.203: 20.75,8.34 21.31,10.28 21.79,11.1 21.79,15.95 RA2.P$5
  Top 0.305: JTAG.11 20.75,8.34
JTAG_R-TO-GND-17
  Top 0.203: JTAG.17 13.18,9.5 14.9,10.33 15.77,11.88 15.77,14.92 14.83,15.24 RA1.P$2
JTAG_R-TO-GND-19
  Top 0.203: 10.59,8.35 10.6,9.53 11.74,10.03 14.33,10.81 15.31,12.09 15.31,14.28 14.74,14.44 RA1.P$3
  Top 0.406: JTAG.19 10.59,8.35
JTCK  (via drill 0.6)
  Top 0.203: 23.3,8.33 24.28,9.5 24.49,9.8 27.96,12.66 27.91,13.29 27.54,13.75 RA3.P$8 | IC5.76 46.38,38.55 45.06,39.84 43.31,40.51 41.15,40.14 36.65,37.07 36.66,33.26 v36.63,31.94
  Top 0.254: JTAG.9 23.3,8.33
  Bottom 0.203: v36.63,31.94 35.93,32.02 35.32,31.68 35.07,30.84 34.66,24.9 29.96,12.78 23.3,8.33 JTAG.9
JTDI  (via drill 0.6)
  Top 0.203: JTAG.5 28.38,9.67 28.57,10.44 29.46,12.09 29.46,14.31 28.53,15.36 RA3.P$6 | IC5.77 46.17,38.05 44.92,39.36 43.31,40 41.39,39.6 37.15,36.75 37.12,33.31 37.63,31.88 37.3,30.93 v36.77,29.29
  Bottom 0.203: JTAG.5 28.39,8.25 31.03,11.73 35.66,24.48 36.24,28.11 v36.77,29.29
JTDO  (via drill 0.6)
  Top 0.203: 18.29,8.37 18.26,10.29 19.67,11.78 20.41,13.03 | IC5.89 46.54,32.05 45.76,31.65 44.29,31.11 43.59,30.53 41.83,30.59 v40.74,30.68
  Top 0.406: JTAG.13 18.29,8.37 | 20.41,13.03 RA2.P$8
  Bottom 0.203: v40.74,30.68 39.47,31.39 38.11,31.52 37.08,32.75 36.24,32.76 35.45,32.4 34.76,31.89 34.4,30.89 34.13,25.19 29.64,13.53 19.66,10.12 18.34,8.33 JTAG.13
JTIMS  (via drill 0.6)
  Top 0.203: 25.84,8.31 26.17,9.33 26.46,9.84 26.74,10.62 28.77,12.43 28.75,13.84 28,14.55 RA3.P$7 | IC5.72 50.98,41.72 50.07,42.62 47.94,42.74 47.57,42.85 47.12,43.2 45.83,43.16 45.34,42.94 44.97,42.74 44.32,42.62 40.95,40.55 36.14,37.37 36.14,34.38 35.86,32.82 35.78,31.89 v36.04,30.76
  Top 0.406: JTAG.7 25.84,8.31
  Bottom 0.203: JTAG.7 30.43,12.22 35.13,24.74 v36.04,30.76
JTRST  (via drill 0.6)
  Top 0.203: 30.96,8.34 30.98,10.15 30.49,11.46 30.32,14.41 28.62,16.15 RA3.P$5 | IC5.90 46.62,31.55 44.62,30.7 43.76,30.08 42.33,30.03 v38.7,28
  Top 0.406: JTAG.3 30.96,8.34
  Bottom 0.203: v38.7,28 36.8,27.71 36.28,24.52 31.98,12.53 31.39,9.94 JTAG.3
MAX3232_DUAL_FET  (via drill 0.6)
  Top 0.203: R8.2 23.79,34.51 25.3,32.83 25.3,30.19 v23.95,29.09
  Bottom 0.203: QQ100.P$6 26.1,34.03 27.35,34.03 27.46,31.6 27.49,30.79 30.12,27.39 30.13,26.58 29.49,24.84 27.78,24.84 24.41,27.55 24.26,28.35 24.11,29.59 24.15,29.96 24.14,30.76 QQ100.P$3 24.07,30.17 v23.95,29.09
MAX3232_VCC  (via drill 0.6)
  Top 0.203: 30.63,32.04 IC2.16
  Top 0.305: 26.92,36.77 26.95,36.77 C7.1
  Top 0.406: 30.63,32.04 30.65,33.83 v26.92,34.98 26.92,36.77 26.92,36.81
  Bottom 0.203: QQ100.P$4 24.14,33.3
  Bottom 0.406: 24.96,34.55 Q100.3 | 24.96,34.55 24.15,34.24 24.14,33.3 | 24.96,34.55 v26.92,34.98
NRST  (via drill 0.6)
  Top 0.203: v56.4,21.48 55.98,22.74 | v29.75,16.33 v35.61,13.95 | TO_RJ-1.3 4.91,11.52 9.57,7.03 14.62,7.03 15.72,8.43 JTAG.15 15.7,8.18 15.87,9.86 16.27,10.4 16.29,15.38 14.98,16.05 | 14.98,16.05 RA1.P$1 | 14.98,16.05 v15.93,16.4
  Top 0.24: 55.98,22.74 IC5.14
  Bottom 0.203: v56.4,21.48 54.55,22.11 53.49,22.1 50.98,21.15 46.45,17.54 46.18,15.78 v35.61,13.95 | v29.75,16.33 28.49,13.84 18.21,10.35 15.64,8.36 JTAG.15 | v15.93,16.4 14.69,17.63 14.61,18.38 SW100.P$2
OP-AMP_ADJ
  Bottom 0.203: R120.1 80.24,19.33 79.87,19.73 79.85,20.37 80.26,20.65 84.79,21.8 84.77,23.8 R119.S
OP_AMP_FB_1
  Top 0.203: R27.1 77.03,14.76 77.64,14.4 79.28,14.4 79.6,14.74 79.6,16.13 IC9.1
OP_AMP_FB_8
  Top 0.203: R27.2 77.03,21.68 77.79,22.33 78.44,23.24 79.22,23.24 79.64,22.84 IC9.8
OP_AMP_GAIN
  Top 0.203: R32.2 80.78,23.73 81.61,23.45 83.42,23.45 | 83.42,23.45 83.83,23.46 84.28,23.46 84.6,23.76 84.6,24.25 C22.1 | 83.42,23.45 83.39,23.44 IC9.5
OP_AMP_OUT  (via drill 0.6)
  Top 0.203: IC9.6 82.11,19.68 v78.52,18.83
  Bottom 0.203: v78.52,18.83 79.71,17.94 80,17.45 79.98,16.88 R112.2
OP_AMP_OUT_1ST_RC
  Bottom 0.203: R110.1 75.73,16.94 76.32,16.94 | R112.1 76.71,16.81 76.32,16.94 | 76.32,16.94 76.3,17.06 76.29,19.03 C122.1
OSC_IN
  Top 0.203: 49.68,15.56 51.59,16.21 53.59,17.02 54.93,20.11 54.98,23.16 54.98,24.43 | C11.2 48.2,6.8 48.32,6.28 P17.MP | 49.59,8.36 49.67,8.41 49.67,8.42 R13.1
  Top 0.24: IC5.12 54.94,24.55 54.98,24.43 54.98,24.46 | 49.67,13.09 47.04,13.64 | X1.2 49.67,13.09 | 49.67,13.09 49.68,15.56
  Top 0.406: 49.61,8.35 49.6,7.78 C11.2 49.59,7.76 49.59,8.36 49.6,13.64 X1.2
OSC_OUT
  Top 0.203: IC5.13 55.48,22.68 55.53,20.22 55.27,17.5 R15.1
OSC_OUT_XTAL
  Top 0.203: 57.18,13.57 57.21,13.15 R15.2 | 54.25,8.4 54.29,8.42 R13.2
  Top 0.24: 54.92,12.99 54.92,12.92 | 54.9,12.99 54.92,12.99 | 58.59,13.67 57.18,13.57 54.8,13.39 54.92,12.99
  Top 0.406: X1.1 54.9,12.99 54.26,12.77 54.25,8.4 54.26,7.56 54.27,7.42 C15.2
P1_RS485_Y
  Bottom 0.203: 9.91,69.79 IC100.5 | P1.MP 3.32,72.93
  Bottom 0.305: 9.91,69.79 8.16,70.72 5.96,71.19 3.32,72.93
P5-RS485_Z
  Bottom 0.203: 11.22,70.69 IC100.6 | P5.MP 5.75,72.9
  Bottom 0.305: 11.22,70.69 10.49,70.97 9.08,71.24 7.33,71.74 5.75,72.9
P6_RS485_B
  Bottom 0.203: 7.83,72.59 P6.MP
  Bottom 0.305: 7.83,72.59 9.84,71.84 11.15,71.41 12.5,70.89 IC100.7 12.55,69.34 12.53,67.96 13.01,67.41 15.06,66.59 15.2,65.21 16.27,65.21 R100.1
P7_RS485_A
  Bottom 0.203: P7.MP 10.28,72.81
  Bottom 0.305: 10.28,72.81 11.52,71.99 13.77,71.15 IC100.8 13.78,68.03 14.41,68.03 15.06,68.9 16.29,68.92 R100.2
P13_CANL
  Bottom 0.203: IC103.6 37.05,67.76 37.05,69.57 36.36,70.88 P13.MP
P14_CANH
  Bottom 0.203: IC103.7 38.34,69.54 38.52,70.14 38.5,71.19 P14.MP
P15_FET_DRAIN
  Bottom 0.203: Q102.3 43.47,22.18 P15.MP
P28_+7V_VIA_R
  Bottom 0.61: 80.79,5.88 80.74,5.94 80.7,7.61 C127.1 | R113.1 80.41,1.69 80.72,2.5 80.66,3.96 P28.MP
  Bottom 1.016: P28.MP 80.79,5.88
P29_BEEP_FET_DRAIN
  Top 0.203: P29.MP 83.07,4.02
  Top 0.61: 83.16,5.9 Q1.3
  Top 0.813: 83.07,4.02 83.16,5.9
P_FET_DRAIN_SWITCHED_BOTTOMCELL  (via drill 0.6)
  Top 0.203: v23.08,43.66 22.68,40.7 18.98,40.7 18.98,40.64 | v29.02,50.7 29.02,52.47 28.47,53.16 26.7,53.17 QQ1.P$4 | 18.98,40.64 18.98,40.58 | R3.1 18.98,40.64
  Bottom 0.203: v23.08,43.66 23.72,44.31 25.06,48.03 v29.02,50.7
P_FET_DRAIN_SWITCHED_TOPCELL  (via drill 0.6)
  Top 0.203: QQ2.P$4 29.03,45.02 29.01,45.36 v29.46,45.78 | v21.15,43.9 20.23,44.77 18.91,44.77 18.91,44.8 R1.1
  Bottom 0.203: v29.46,45.78 23.16,42.06 22.4,42.24 v21.15,43.9
PA0_WKUP
  Top 0.203: R18.2 64.16,18.27 R17.1 63.17,20.24 62.52,21.8 61,22.78 60.63,23.24 60.48,23.53 IC5.23
PA0_WKUP|RJ-45  (via drill 0.6)
  Top 0.203: v67.61,17.72 R18.1
  Bottom 0.203: v67.61,17.72 65.61,15.96 58.65,1.88 5.7,1.88 5.78,16.16 7.21,21.22 9.74,24.94 9.83,26.32 9.29,27.09 9.11,27.97 9.11,32.69 7.84,33.45 U$1.6
PA1_SPARE  (via drill 0.6)
  Top 0.203: IC5.24 60.98,24.44 61,23.49 61.24,23.2 63.18,21.97 66.93,21.84 67.82,21.95 v69.01,21.87 72.64,21.87 73.17,21.48 73.17,20.63 73.03,20.24 72.31,20.24 R20.2
  Bottom 0.203: R109.1 69.22,19.98 v69.01,21.87
PA1|RJ-45_SPARE  (via drill 0.6)
  Top 0.203: v67.73,19.49 68.18,19.75 68.55,19.97 68.92,20.22 69.18,20.23 R20.1
  Bottom 0.203: U$1.3 10.54,30.19 11.99,29.24 12.01,26.28 7.68,20.8 6.37,15.97 6.37,2.31 58.31,2.35 66.83,19.36 v67.73,19.49
PA2_TIM2_CH2|BEEP_FET  (via drill 0.6)
  Top 0.203: IC5.25 61.48,23.69 62.99,22.64 63.65,22.64 v64.71,22.99 | v57.47,9.18 63.01,5.69 65.21,5.69 65.95,5.31 65.95,3.21 66.66,2.32 78.17,2.33 79.54,2.33 82.34,2.32 86.7,2.31 86.71,8.74 85,9.19 Q1.1 | 78.92,9.82 R30.1 79.52,9.75 79.52,10.46 80.29,10.46 83.78,10.46 84.09,10.14 Q1.1 | Q1.1 84.03,9.19
  Bottom 0.203: v64.71,22.99 63.99,21.21 58.44,9.9 v57.47,9.18
PA3_ADC123_IN3|THERMISTOR_32KHZ  (via drill 0.6)
  Top 0.203: IC5.26 64.61,26.54 64.92,26.16 64.61,25.4 v63.69,24.62
  Bottom 0.203: R106.2 51.59,7.12 52.4,7.48 52.4,8.32 THRM100.1 52.49,7.48 54.45,7.48 56.85,10.1 58.28,10.8 59.02,12.34 | 59.02,12.34 63.54,21.61 63.1,23.63 v63.69,24.62 | 59.02,12.34 59.03,12.34 | 59.02,12.34 58.65,12.47 C107.1
PA5_SPI1_SCK_AD7799_SCK  (via drill 0.6)
  Top 0.203: IC5.30 64.58,28.54 65.47,27.85 v66.25,26.7 | v65.83,39.7 66.55,39.02 66.99,38.92 67.55,39.07 68.02,39.33 v69.03,40.23 | v70.74,41.91 69.2,44.05 65.95,44.06 64.2,48.81 64.13,49.62 64.38,52.19 64.63,54.41 66.79,55.83 67.5,56.2 v67.86,56.87 67.86,57.65 67.66,57.85 66.8,57.85 IC7.1
  Bottom 0.203: v66.25,26.7 65.33,28.66 65.28,30.76 65.95,34.72 66.27,35.8 66.29,38.53 v65.83,39.7 | v69.03,40.23 v70.74,41.91 | v67.86,56.87 69.59,55.66 IC104.1
PA6_SPI1_MISO_AD7799_DOUT/RDY  (via drill 0.6)
  Top 0.203: v66.03,41.14 65.71,41.9 65.19,43.25 62.96,49.59 62.1,50.28 60.92,50.74 57.99,51.87 56.5,54.6 56.89,55.42 57.08,55.91 | v67.05,27.82 65.75,28.32 64.77,29.04 64.67,29.05 IC5.31 | 60.87,58.48 IC7.15 60.82,58.47 59.59,58.49 57.89,57.56 57.08,55.91 | 57.08,55.91 57.19,56 v57.16,56.06
  Bottom 0.203: v66.03,41.14 66.82,41.06 67.25,41.02 67.98,40.57 68.19,39.92 68.13,39.25 67.62,38.76 67.36,35.74 66.85,34.18 66.5,30.9 67.11,29.74 67.36,29.05 v67.05,27.82 | IC104.15 64.29,55.01 63.91,55.36 62.73,56.18 60.81,56.29 59.16,56.23 58.69,55.99 v57.16,56.06
PA7_SPI1_MOSI_AD7799_DIN  (via drill 0.6)
  Top 0.203: 58.53,56.91 58.12,56.16 57.84,55.57 57.05,54.58 58.29,52.24 60.91,51.22 62.42,50.69 63.29,50.03 63.82,48.58 65.6,43.66 65.92,42.94 66.24,42.34 66.83,41.81 67.14,41.08 v67.23,39.88 | v66.36,29.01 65.39,29.55 63.65,29.55 IC5.32 | 60.91,57.83 IC7.16 59.85,57.84 59.15,57.48 | 58.53,56.91 58.8,56.91 | 58.53,56.91 58.68,57.03 59.15,57.48 | 59.15,57.48 58.88,57.18 v58.53,56.93
  Bottom 0.203: v67.23,39.88 66.94,38.51 66.87,35.81 66.39,34.46 65.9,30.61 v66.36,29.01 | IC104.16 64.29,55.64 62.84,56.86 v58.53,56.93
PA8_GPIO|SD_CARD_REG_ENABLE  (via drill 0.6)
  Top 0.203: IC1.4 21.67,60.18 21.67,59.78 21.26,59.43 20.39,59.43 | 20.39,59.43 20.36,59.43 19.53,59.43 19.14,59.9 R5.2 | 20.39,59.43 20.39,59.42 v20.38,60.37 | v51.71,46.75 52.27,45.32 53.48,42.93 53.48,42.31 IC5.67 | v29.18,57.81 30.97,58.72 36.83,58.99 v38.26,59.97
  Bottom 0.203: v20.38,60.37 24.83,62.99 26.95,62.6 v29.18,57.81 | v38.26,59.97 41.04,57.29 44.02,54.63 46.23,52.95 48.56,50.05 49.57,48.79 50.91,47.23 v51.71,46.75
PA9_USART1_TX  (via drill 0.6)
  Top 0.203: IC2.11 30.88,25.67 32.93,25.68 v33.27,25.68 v33.26,25.68 | IC5.68 52.98,42.57 52.47,43.79 51.7,45.01 43.98,44.98 35.36,44.27 33.82,41.34 33.82,30.89 33.83,29.62 34.02,29.27 34.07,28.79 33.81,28.52 v33.27,27.9
  Bottom 0.203: v33.27,27.9 33.33,27.29 v33.26,25.68
PA10_USART1_RX
  Top 0.203: IC2.12 30.84,26.96 33.69,26.96 34.26,27.61 34.67,28.65 34.51,29.34 34.26,30.56 34.26,41.08 35.61,43.82 43.95,44.51 51.44,44.5 52.04,43.45 52.48,42.26 IC5.69
PA11_CAN_RX|CAN_RXD  (via drill 0.6)
  Top 0.203: IC5.70 52,42 v50.94,43.66 | v29.6,59.72 33.26,60.11 v33.88,61.68
  Bottom 0.203: v50.94,43.66 50.13,44.23 47.94,45.76 44.63,50.64 43.21,52.09 39.22,54.78 36.69,55.53 30.97,59.03 v29.6,59.72 | v33.88,61.68 35.27,60.85 35.87,61.13 35.79,62.51 IC103.4
PA12_CAN_TX|CAN_TXD  (via drill 0.6)
  Top 0.203: IC5.71 51.47,41.91 50.5,42.91 v49.48,43.62 | v31.02,57.82 v37.85,58.68
  Bottom 0.203: v49.48,43.62 47.45,45.38 45.19,48.84 44.4,50.09 42.9,51.62 39.03,54.28 36.41,55.09 32.52,57.51 v31.02,57.82 | v37.85,58.68 37.34,59.46 37.26,60.17 37.62,60.87 38.1,61.02 39.56,61.2 39.63,62.4 IC103.1
PB0_ADC_IN8|BOTTOM_CELL  (via drill 0.6)
  Top 0.203: v15.54,36.76 15.6,37.55 15.69,38.44 15.86,38.41 | v68.98,30.24 66.53,31.09 65.36,31.05 63.53,31.05 IC5.35 | v66.18,24.48 v69.68,24.26 | 15.86,38.41 R4.1 | 15.86,38.41 15.86,40.62 17,40.58 R3.2
  Bottom 0.203: 67.05,24.46 56.78,4.28 8.78,4.33 8.72,15.86 9.74,19.31 14.32,25.68 14.15,36.1 15.01,36.28 15.38,36.75 v15.54,36.76 | 67.05,24.46 68.46,27.38 68.56,28.27 v68.98,30.24 | 67.05,24.46 v66.18,24.48 | v69.68,24.26 70.12,24.08 70.69,24.02 71.06,23.52 71.24,22.72 71.57,22.52
  Bottom 0.406: C119.1 71.56,22.51 71.57,22.52
PB1_ADC8|BOTTOM_CELL  (via drill 0.6)
  Top 0.203: QQ1.P$2 25.73,48.92 24.93,48.46 24.95,47.69 R9.1
  Top 0.406: JP2.2 6.88,42.54 8.21,39.95 7.94,35.25 U$1.8
  Top 0.61: v22.34,47.66 R9.1
  Bottom 0.203: JP2.2 6.72,45.49
  Bottom 0.61: 10.32,51.57 17.43,51.54 19.4,49.4 20.05,48.58 22.16,47.66 v22.34,47.66
  Bottom 0.813: 6.72,45.49 6.75,48.14 10.32,51.57
PB1_ADC_IN9|TOP_CELL  (via drill 0.6)
  Top 0.203: v14.75,41.12 15.09,42.12 15.8,42.7 | v70.59,30.58 69.41,31.25 68.89,31.42 68.58,31.5 67.53,31.6 66.93,31.65 65.22,31.55 63.7,31.56 IC5.36 | R1.2 15.98,44.81 15.77,44.8 15.76,44.28 15.8,43.68 15.82,43.26 15.8,42.7 | R2.1 16.94,42.69 16.94,42.7 15.8,42.7
  Bottom 0.203: v14.75,41.12 14.25,40.34 14.27,39.44 14.28,38.2 14.05,37.05 13.55,36.58 13.79,25.83 9.28,19.73 8.16,15.73 8.14,3.88 57.04,3.8 68.07,25.3 68.88,27.06 69.2,27.79 69.36,28.36 69.98,29.51 v70.59,30.58 70.93,30.24 71.23,29.97 71.39,29.81 71.62,29.51 71.73,29.19 C118.1
PB2_BOOT1  (via drill 0.6)
  Top 0.203: IC5.37 65.03,32.05 66.65,32.08 67.5,32.21 68.15,32.17 68.93,32.07 v70.17,31.96
  Bottom 0.203: v70.17,31.96 70.67,31.86 72.29,31.61 BOOT1.MP 73.56,32.56 74.4,33.82 74.74,34.05 75.23,34.05 75.53,33.78 75.53,33 R111.2
PB5_GPIO|XBEE_REG_CE  (via drill 0.6)
  Top 0.203: v42.14,47.12 v34.7,46.95 | IC5.91 46.58,31.05 45.93,30.57 v45.73,30.25
  Bottom 0.203: v45.73,30.25 46.93,36.31 46.64,38.13 45.87,39.88 45.6,40.77 45.73,42.05 45.31,43.85 45.13,44.19 43.79,46.02 R104.1 42.99,47.12 v42.14,47.12 | IC102.3 33.71,48.86 33.87,48.36 34.11,47.93 v34.7,46.95
PB6
  Top 0.203: IC5.92 48.99,30.53 49.98,31.1 P35.MP
PB7
  Top 0.203: IC5.93 49,30.02 49.97,29.49 P34.MP
PB8_GPIO|XB_DTR/SLEEP_RQ  (via drill 0.6)
  Top 0.203: IC5.95 46.56,29.05 45.78,28.91 42.66,29.02 41.4,28.26 v41.39,27.2
  Bottom 0.203: IC101.P$9 41.2,28.62 v41.39,27.2
PB9_GPIO|XB_/RESET  (via drill 0.6)
  Top 0.203: IC5.96 46.46,28.55 45.79,28.49 43.5,28.56 v42.81,27.39
  Bottom 0.203: v42.81,27.39 42.91,28.39 42.36,30.77 42.32,31.83 42.9,32.16 42.51,34.53 42.47,34.94 41.73,35.71 41.2,36.66 IC101.P$5
PB10_GPIO|AD7799_1/CS  (via drill 0.6)
  Top 0.203: IC5.47 65.95,37.05 67.55,38.09 v70.09,38.69 | v71.71,40.28 71.7,41.38 71.71,42.28 69.35,44.62 66.22,44.62 64.8,48.53 64.69,49.4 65.06,54.13 66.9,55.37 68.43,55.91 69.27,56.38 69.33,57.96 68.73,58.5 67.84,58.5 66.58,58.49 IC7.2
  Bottom 0.203: v70.09,38.69 v71.71,40.28
PB11_PAD
  Top 0.203: IC5.48 65.78,37.51 67.34,38.49 68.86,39.09 69.42,39.37 69.93,39.71 70,40.26 69.59,41.03 68.96,41.48 P20.MP
PB12_SPI2_NSS|SD_CD  (via drill 0.6)
  Top 0.203: U$2.P$1 15.26,66.83 17.67,66.62 23.16,66.44 24.99,66.4 v26.44,66.75 | v61.95,45.58 62.42,43.85 62.49,43.2 62.29,42.46 61.48,41.52 61.48,40.63 IC5.51
  Bottom 0.203: v26.44,66.75 26.76,65.25 31.57,59.95 37.27,56.38 39.49,55.86 43.59,52.99 45.28,51.52 48.74,46.49 50.5,45.39 54.63,43.51 59.04,44.16 59.73,44.23 60.28,44.34 60.97,44.67 v61.95,45.58
PB13_SPI2_SCK|SD_SCK  (via drill 0.6)
  Top 0.203: U$2.P$5 25.22,68.54 26.99,68.22 v28.55,67.58 | v60.71,46.54 61.06,45.7 61.22,45.01 61.74,44.54 61.93,43.7 61.96,43.23 61.85,42.75 60.98,41.55 60.98,41.11 IC5.52
  Bottom 0.203: v28.55,67.58 30.82,66.67 31.62,66.24 32.77,60.41 37.73,57.27 39.76,56.94 44.08,53.94 45.98,52.4 49.76,47.01 51.18,46.04 54.75,44.51 58.87,45.09 59.43,45.9 v60.71,46.54
PB14_SPI2_MISO|SD_DO  (via drill 0.6)
  Top 0.203: U$2.P$7 30.13,67.18 30.77,64.79 30.84,63.91 U$3.P$7 v30.85,65.69 | v60.23,45.26 61.28,44.34 61.48,43.66 61.48,43.31 61.33,42.85 60.47,41.6 IC5.53
  Bottom 0.203: v30.85,65.69 32.27,60.1 37.5,56.83 39.62,56.4 43.86,53.45 45.58,51.96 49.28,46.73 50.92,45.68 54.69,44.01 58.98,44.63 59.48,44.77 v60.23,45.26
PB15_SPI2_MOSI|SD_CMD_DI  (via drill 0.6)
  Top 0.203: U$2.P$2 17.72,67.14 21.91,66.91 23.47,66.9 v24.35,67.25 | v60.67,43.51 60.4,42.57 59.99,41.58 59.99,40.67 IC5.54
  Bottom 0.203: v24.35,67.25 31.19,59.52 37.02,55.94 39.31,55.34 43.44,52.53 44.87,51.16 48.27,46.23 50.09,44.99 54.62,42.99 58.71,43.66 59.66,43.66 v60.67,43.51
PC0_ADC12_IN11|X-AXIS
  Top 0.203: IC5.15 56.48,22.85 57.1,22.1 59.73,14.79 64.08,6.23 67.75,6.24 69.73,5.18 JP7.4
PC1_ADC12_IN11|Y-AXIS
  Top 0.203: IC5.16 56.98,22.97 57.5,22.34 60.24,14.84 64.39,6.67 67.93,6.68 71.54,5.52 JP7.3
PC2_ADC12_IN12|Z-AXIS
  Top 0.203: IC5.17 57.48,23.18 57.95,22.46 60.76,14.85 64.68,7.14 68,7.12 73.81,5.9 JP7.2
PC4_GPIO|TOP_CELL_ENABLE  (via drill 0.6)
  Top 0.203: v13.39,38.74 13.75,36.08 14.38,35.44 15.39,35.25 16.72,35.46 17.97,35.71 19.55,36.62 20.95,37.7 23.35,39.31 24.82,39.62 24.76,41.79 R7.2 27.15,41.79 QQ2.P$1 | v70.02,27.16 67.8,29.29 66.89,29.82 66.27,30.04 64.59,30.04 63.65,30.04 IC5.33
  Bottom 0.203: v13.39,38.74 13.3,37.89 13.12,37.36 13.02,35.87 13.2,25.93 8.79,20.21 7.54,15.66 7.52,3.38 57.6,3.37 69.34,26.69 v70.02,27.16
PC5_GPIO|BOTTOM_CELL_ENABLE  (via drill 0.6)
  Top 0.203: v12.87,40.73 13.77,42.3 14.01,44.15 15.02,45.93 19.76,46.24 20.99,49.46 R6.2 24.82,49.71 QQ1.P$1 | v70.79,28.95 69.08,29.03 68.57,29.23 67.85,29.87 67,30.38 66.38,30.53 65.59,30.55 IC5.34
  Bottom 0.203: v12.87,40.73 12.26,39.14 12.49,36.19 12.6,26.09 8.3,20.52 6.95,15.69 6.93,2.86 58.01,2.87 67.25,21.37 69.06,25.02 70.81,26.2 71.12,26.86 71.09,27.36 70.93,28.53 v70.79,28.95
PC6_TIM3_CH1*|ENCODER_2_B  (via drill 0.6)
  Top 0.203: IC5.63 55.48,44.04 55.96,45.03 56.01,46.06 55.53,47.02 v53.86,48.15
  Bottom 0.203: v53.86,48.15 53.02,50.71 51.76,53.7 46.84,64.18 45.67,65.69 44.64,67.2 44.44,68.18 JP6.2
PC7_TIM3_CH2*|ENCODER_2_A  (via drill 0.6)
  Top 0.203: IC5.64 v54.98,45.95
  Bottom 0.203: v54.98,45.95 54.74,48.47 47.32,64.43 47.14,65 46.88,66.88 46.78,70 46.76,69.7 JP6.3
PC8  (via drill 0.6)
  Top 0.203: IC5.65 54.47,40.54 54.48,43.35 53.31,46.57 53.1,47.09 52.69,48.78 v51.78,49.7
  Bottom 0.203: v51.78,49.7 50.89,50.49 50.84,52.8 48.38,58.38 47.37,59.76 P16.MP
PC9_TIM8_CH4|GPS_1PPS  (via drill 0.6)
  Top 0.203: IC5.66 53.98,42.98 52.78,46 52.67,46.73 52.42,47.45 v51.52,48.02 | v44.77,55.34 43.98,53.97 42.38,52.03 40.3,52.03 31.45,52.03 v30.4,52.31
  Bottom 0.203: v51.52,48.02 50.68,48.47 49.25,50.09 46.64,53.32 v44.77,55.34 | v30.4,52.31 28.1,53.08 17.33,55.48 12.01,56.15 7.77,57.26 6.25,61 JP1.4
PC10_UART4_TX  (via drill 0.6)
  Top 0.203: IC2.10 28.52,24.45 28.52,22.25 32.74,22.25 36.09,22.96 36.7,23.61 v37.49,24.1 | v43.33,39.03 44.34,38.92 45.58,37.88 46.1,37.55 IC5.78
  Bottom 0.203: v37.49,24.1 40.02,24.42 43.24,26 44.2,26.73 44.19,30.13 44.55,31.08 44.61,32.37 44.13,34.31 43.72,36.29 43.72,38.02 v43.33,39.03
PC11_UART4_RX  (via drill 0.6)
  Top 0.203: IC2.9 32.32,23.16 35.65,23.72 v37.53,25.4 | v42.09,38.5 43.02,38.06 44.41,38.1 45.99,37.04 IC5.79
  Bottom 0.203: v37.53,25.4 38.54,24.75 39.94,24.86 42.91,26.46 43.72,26.92 43.72,30.25 44.06,31.09 44.11,32.06 43.99,32.55 43.52,34.71 43.26,36.06 43.15,37.72 v42.09,38.5
PC12_USART5_TX|GPS_RX  (via drill 0.6, 0.9)
  Top 0.203: IC5.80 45.89,36.55 v44.7,36.89 | JP1.3 5.51,63.85 8.75,60.95 v9.17,61.22